# EAGLE schematic board4 (EAGLE 7.0.0)
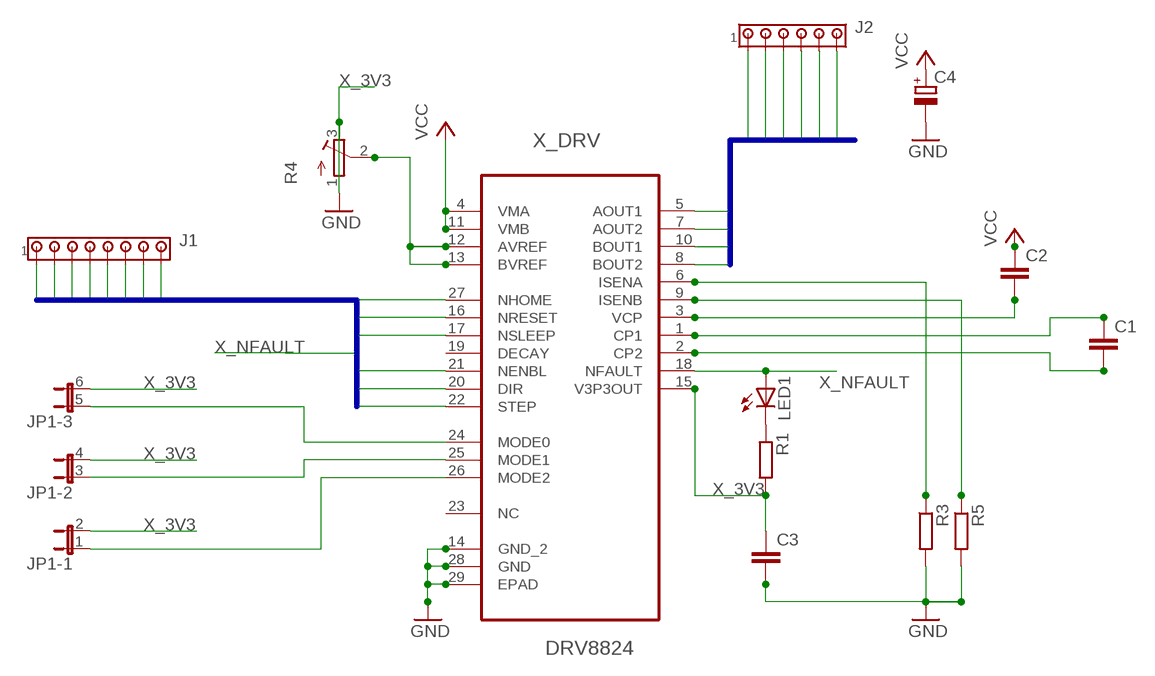
[diagram p0: schematic, sheet 1]

## Parts
C1  C-EUC0805  [C0805]
C2  C-EUC0805  [C0805]
C3  C-EUC0805  [C0805]
C4  CPOL-EUE5-10.5  [E5-10,5]
J1  MTA08-100  [10X08MTA]
J2  MTA06-156  [1X6MTA]
JP1  JP3QE  [JP3Q]
LED1  LEDCHIPLED_0805  [CHIPLED_0805]
R1  R-EU_M0805  [M0805]
R3  R-EU_M0805  [M0805]
R4  R-TRIMM4G/J  [RTRIM4G/J]
R5  R-EU_M0805  [M0805]
X_DRV  DRV8824  DRV8824PWPR  [SOP65P640X120-29N]

## Nets
GND [POWER]: C3.2 C4.- J1.8 J2.5 R3.2 R4.3(E) R5.2 X_DRV.14(GND_2) X_DRV.28(GND) X_DRV.29(EPAD)
N$1: JP1.1 X_DRV.26(MODE2)
N$2: JP1.3 X_DRV.25(MODE1)
N$3: JP1.5 X_DRV.24(MODE0)
N$5: LED1.C R1.1
N$9: R4.2(S) X_DRV.12(AVREF) X_DRV.13(BVREF)
N$10: C1.1 X_DRV.1(CP1)
N$11: C1.2 X_DRV.2(CP2)
N$12: C2.2 X_DRV.3(VCP)
N$19: R3.1 X_DRV.6(ISENA)
N$20: R5.1 X_DRV.9(ISENB)
VCC [POWER]: C2.1 C4.+ J2.6 X_DRV.4(VMA) X_DRV.11(VMB)
X_3V3: C3.1 JP1.2 JP1.4 JP1.6 R1.2 R4.1(A) X_DRV.15(V3P3OUT)
X_DIR: J1.2 X_DRV.20(DIR)
X_NENBL: J1.3 X_DRV.21(NENBL)
X_NFAULT: J1.7 LED1.A X_DRV.18(NFAULT)
X_NHOME: J1.6 X_DRV.27(NHOME)
X_NRESET: J1.5 X_DRV.16(NRESET)
X_NSLEEP: J1.4 X_DRV.17(NSLEEP)
X_STEP: J1.1 X_DRV.22(STEP)
XOUT0: J2.1 X_DRV.5(AOUT1)
XOUT1: J2.2 X_DRV.7(AOUT2)
XOUT2: J2.3 X_DRV.10(BOUT1)
XOUT3: J2.4 X_DRV.8(BOUT2)
Unconnected: X_DRV.19(DECAY) X_DRV.23(NC)

## Buses
X_STEP,X_DIR,X_NENBL,X_NSLEEP,X_NRESET,X_NHOME,X_NFAULT,GND
XOUT[0..3],VCC,GND

## Library data of the parts
C1-C3 = rcl:C-EU: CAPACITOR, European symbol
C4 = rcl:CPOL-EU: POLARIZED CAPACITOR, European symbol
J1 = con-amp:MTA08-100: AMP connector; OC_FARNELL: unknown; OC_NEWARK: unknown
J2 = con-amp:MTA06-156: AMP connector; OC_FARNELL: unknown; OC_NEWARK: unknown
JP1 = jumper:JP3QE: JUMPER
LED1 = led:LED: LED OSRAM: - CHIPLED LG R971, LG N971, LY N971, LG Q971, LY Q971, LO R971, LY R971 LH N974, LH R974 LS Q976, LO Q976, LY Q976 LO Q996 - Hyper CHIPLED LW Q18S LB Q993, LB Q99A, LB R99A - SideLED LS A670, LO A670, LY A670, LG A670, LP A670 LB A673, LV A673, LT A673, LW A673 LH A674 LY A675 LS A676, LA A676, LO A676, LY A676, LW A676 LS A679, LY A679, LG A679 - Hyper Micro SIDELED® LS Y876, LA Y876, LO Y876, LY Y876 LT Y87S - SmartLED LW L88C, LW L88S LB L89C, LB L89S, LG L890 LS L89K, LO L89K, LY L89K LS L896, LA L896, LO L896, LY L896 - TOPLED LS T670, LO T670, LY T670, LG T670, LP T670 LSG T670, LSP T670, LSY T670, LOP T670, LYG T670 LG T671, LOG T671, LSG T671 LB T673, LV T673, LT T673, LW T673 LH T674 LS T676, LA T676, LO T676, LY T676, LB T676, LH T676, LSB T676, LW T676 LB T67C, LV T67C, LT T67C, LS T67K, LO T67K, LY T67K, LW E67C LS E67B, LA E67B, LO E67B, LY E67B, LB E67C, LV E67C, LT E67C LW T67C LS T679, LY T679, LG T679 LS T770, LO T770, LY T770, LG T770, LP T770 LB T773, LV T773, LT T773, LW T773 LH T774 LS E675, LA E675, LY E675, LS T675 LS T776, LA T776, LO T776, LY T776, LB T776 LHGB T686 LT T68C, LB T68C - Hyper Mini TOPLED® LB M676 - Mini TOPLED Santana® LG M470 LS M47K, LO M47K, LY M47K Source: http://www.osram.convergy.de LUXEON: - LUMILED® LXK2-PW12-R00, LXK2-PW12-S00, LXK2-PW14-U00, LXK2-PW14-V00 LXK2-PM12-R00, LXK2-PM12-S00, LXK2-PM14-U00 LXK2-PE12-Q00, LXK2-PE12-R00, LXK2-PE12-S00, LXK2-PE14-T00, LXK2-PE14-U00 LXK2-PB12-K00, LXK2-PB12-L00, LXK2-PB12-M00, LXK2-PB14-N00, LXK2-PB14-P00, LXK2-PB14-Q00 LXK2-PR12-L00, LXK2-PR12-M00, LXK2-PR14-Q00, LXK2-PR14-R00 LXK2-PD12-Q00, LXK2-PD12-R00, LXK2-PD12-S00 LXK2-PH12-R00, LXK2-PH12-S00 LXK2-PL12-P00, LXK2-PL12-Q00, LXK2-PL12-R00 Source: www.luxeon.com KINGBRIGHT: KA-3528ASYC Source: www.kingbright.com
R1 R3 R5 = rcl:R-EU_: RESISTOR, European symbol
R4 = rcl:R-TRIMM: Trimm resistor
X_DRV = ti_e14:DRV8824PWPR: STEPPER MOTOR CONTROLLER IC; MPN: DRV8824PWPR; OC_FARNELL: -; OC_NEWARK: 74R6336; PACKAGE: TSSOP-28; SUPPLIER: Texas Instruments